# EAGLE schematic joyre_v1_1 (EAGLE 9.3.1)
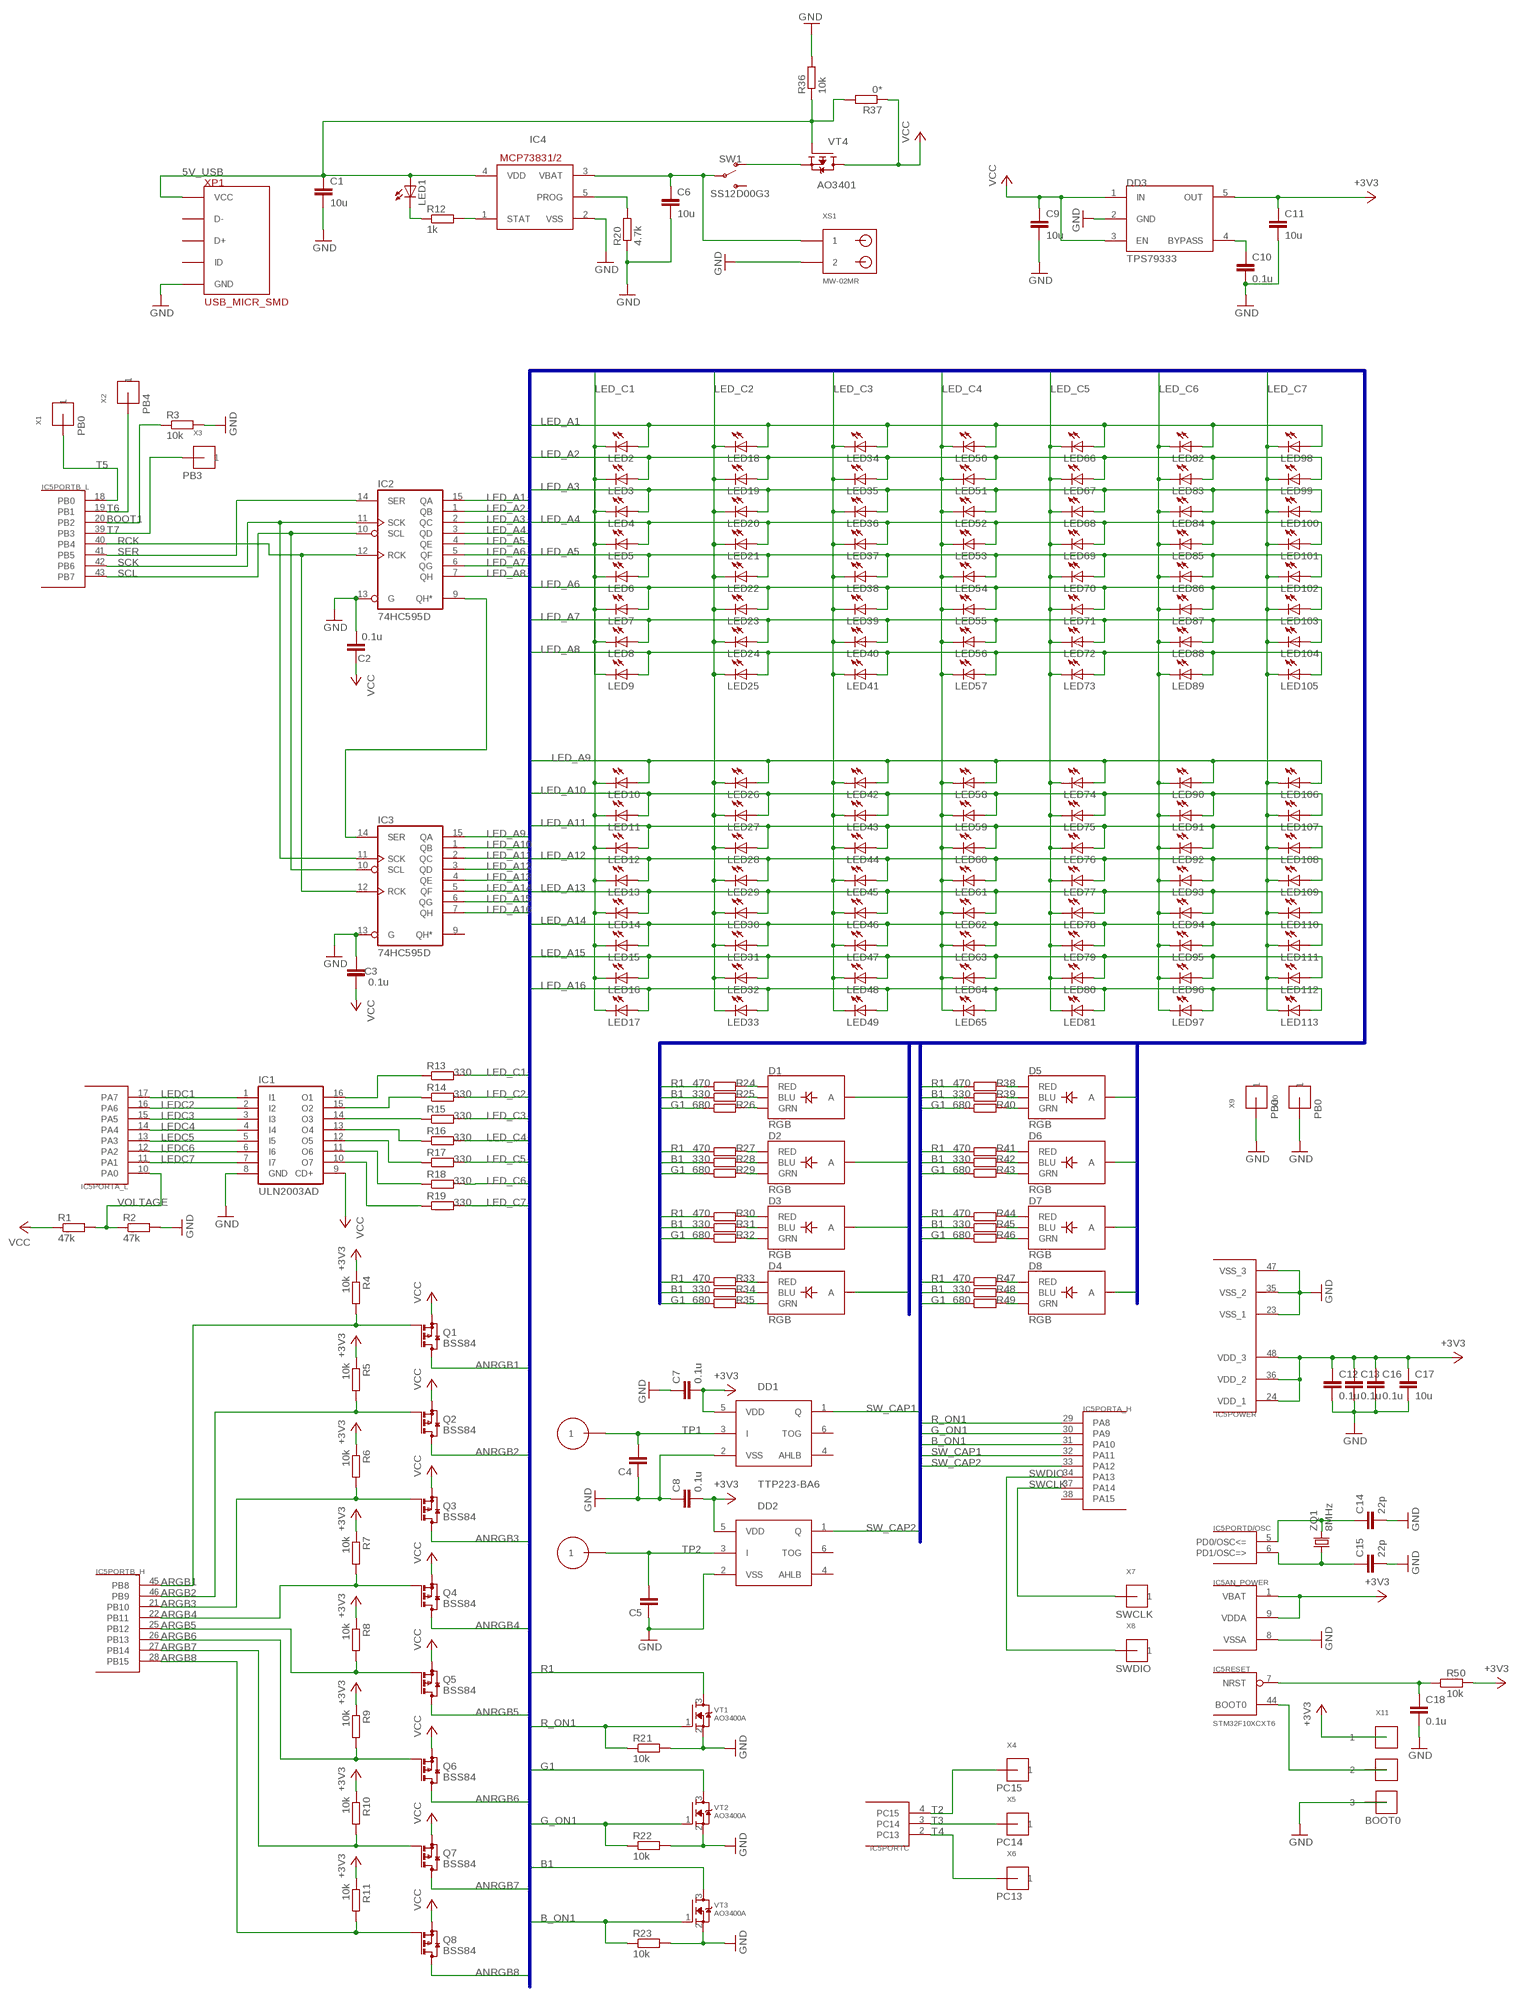
[diagram p0: schematic, sheet 1]

## Parts
C1  10u  C-EUC1206K  [C1206K]
C2  0.1u  C-EUC0603K  [C0603K]
C3  0.1u  C-EUC0603K  [C0603K]
C4  C-EUC0603K  [C0603K]
C5  C-EUC0603K  [C0603K]
C6  10u  C-EUC1206K  [C1206K]
C7  0.1u  C-EUC0603K  [C0603K]
C8  0.1u  C-EUC0603K  [C0603K]
C9  10u  C-EUC1206K  [C1206K]
C10  0.1u  C-EUC0603K  [C0603K]
C11  10u  C-EUC1206K  [C1206K]
C12  0.1u  C-EUC0603K  [C0603K]
C13  0.1u  C-EUC0603K  [C0603K]
C14  22p  C-EUC0603K  [C0603K]
C15  22p  C-EUC0603K  [C0603K]
C16  0.1u  C-EUC0603K  [C0603K]
C17  10u  C-EUC1206K  [C1206K]
C18  0.1u  C-EUC0603K  [C0603K]
D1  RGB  LED-RGB-CAPLCC  [P-LCC-4-3]
D2  RGB  LED-RGB-CAPLCC  [P-LCC-4-3]
D3  RGB  LED-RGB-CAPLCC  [P-LCC-4-3]
D4  RGB  LED-RGB-CAPLCC  [P-LCC-4-3]
D5  RGB  LED-RGB-CAPLCC  [P-LCC-4-3]
D6  RGB  LED-RGB-CAPLCC  [P-LCC-4-3]
D7  RGB  LED-RGB-CAPLCC  [P-LCC-4-3]
D8  RGB  LED-RGB-CAPLCC  [P-LCC-4-3]
DD1  TTP223-BA6  [TSOT23-6]
DD2  TTP223-BA6  [TSOT23-6]
DD3  TPS79333  [DBV_R-PDSO-G5]
IC1  ULN2003AD  [SO16]
IC2  74HC595D  [SO16]
IC3  74HC595D  [SO16]
IC4  MCP73831/OT  [SOT23-5L]
IC5  STM32F10XCXT6  [TQFP48]
LED1  LEDCHIPLED_0805  [CHIPLED_0805]
LED2  LEDCHIPLED_0805  [CHIPLED_0805]
LED3  LEDCHIPLED_0805  [CHIPLED_0805]
LED4  LEDCHIPLED_0805  [CHIPLED_0805]
LED5  LEDCHIPLED_0805  [CHIPLED_0805]
LED6  LEDCHIPLED_0805  [CHIPLED_0805]
LED7  LEDCHIPLED_0805  [CHIPLED_0805]
LED8  LEDCHIPLED_0805  [CHIPLED_0805]
LED9  LEDCHIPLED_0805  [CHIPLED_0805]
LED10  LEDCHIPLED_0805  [CHIPLED_0805]
LED11  LEDCHIPLED_0805  [CHIPLED_0805]
LED12  LEDCHIPLED_0805  [CHIPLED_0805]
LED13  LEDCHIPLED_0805  [CHIPLED_0805]
LED14  LEDCHIPLED_0805  [CHIPLED_0805]
LED15  LEDCHIPLED_0805  [CHIPLED_0805]
LED16  LEDCHIPLED_0805  [CHIPLED_0805]
LED17  LEDCHIPLED_0805  [CHIPLED_0805]
LED18  LEDCHIPLED_0805  [CHIPLED_0805]
LED19  LEDCHIPLED_0805  [CHIPLED_0805]
LED20  LEDCHIPLED_0805  [CHIPLED_0805]
LED21  LEDCHIPLED_0805  [CHIPLED_0805]
LED22  LEDCHIPLED_0805  [CHIPLED_0805]
LED23  LEDCHIPLED_0805  [CHIPLED_0805]
LED24  LEDCHIPLED_0805  [CHIPLED_0805]
LED25  LEDCHIPLED_0805  [CHIPLED_0805]
LED26  LEDCHIPLED_0805  [CHIPLED_0805]
LED27  LEDCHIPLED_0805  [CHIPLED_0805]
LED28  LEDCHIPLED_0805  [CHIPLED_0805]
LED29  LEDCHIPLED_0805  [CHIPLED_0805]
LED30  LEDCHIPLED_0805  [CHIPLED_0805]
LED31  LEDCHIPLED_0805  [CHIPLED_0805]
LED32  LEDCHIPLED_0805  [CHIPLED_0805]
LED33  LEDCHIPLED_0805  [CHIPLED_0805]
LED34  LEDCHIPLED_0805  [CHIPLED_0805]
LED35  LEDCHIPLED_0805  [CHIPLED_0805]
LED36  LEDCHIPLED_0805  [CHIPLED_0805]
LED37  LEDCHIPLED_0805  [CHIPLED_0805]
LED38  LEDCHIPLED_0805  [CHIPLED_0805]
LED39  LEDCHIPLED_0805  [CHIPLED_0805]
LED40  LEDCHIPLED_0805  [CHIPLED_0805]
LED41  LEDCHIPLED_0805  [CHIPLED_0805]
LED42  LEDCHIPLED_0805  [CHIPLED_0805]
LED43  LEDCHIPLED_0805  [CHIPLED_0805]
LED44  LEDCHIPLED_0805  [CHIPLED_0805]
LED45  LEDCHIPLED_0805  [CHIPLED_0805]
LED46  LEDCHIPLED_0805  [CHIPLED_0805]
LED47  LEDCHIPLED_0805  [CHIPLED_0805]
LED48  LEDCHIPLED_0805  [CHIPLED_0805]
LED49  LEDCHIPLED_0805  [CHIPLED_0805]
LED50  LEDCHIPLED_0805  [CHIPLED_0805]
LED51  LEDCHIPLED_0805  [CHIPLED_0805]
LED52  LEDCHIPLED_0805  [CHIPLED_0805]
LED53  LEDCHIPLED_0805  [CHIPLED_0805]
LED54  LEDCHIPLED_0805  [CHIPLED_0805]
LED55  LEDCHIPLED_0805  [CHIPLED_0805]
LED56  LEDCHIPLED_0805  [CHIPLED_0805]
LED57  LEDCHIPLED_0805  [CHIPLED_0805]
LED58  LEDCHIPLED_0805  [CHIPLED_0805]
LED59  LEDCHIPLED_0805  [CHIPLED_0805]
LED60  LEDCHIPLED_0805  [CHIPLED_0805]
LED61  LEDCHIPLED_0805  [CHIPLED_0805]
LED62  LEDCHIPLED_0805  [CHIPLED_0805]
LED63  LEDCHIPLED_0805  [CHIPLED_0805]
LED64  LEDCHIPLED_0805  [CHIPLED_0805]
LED65  LEDCHIPLED_0805  [CHIPLED_0805]
LED66  LEDCHIPLED_0805  [CHIPLED_0805]
LED67  LEDCHIPLED_0805  [CHIPLED_0805]
LED68  LEDCHIPLED_0805  [CHIPLED_0805]
LED69  LEDCHIPLED_0805  [CHIPLED_0805]
LED70  LEDCHIPLED_0805  [CHIPLED_0805]
LED71  LEDCHIPLED_0805  [CHIPLED_0805]
LED72  LEDCHIPLED_0805  [CHIPLED_0805]
LED73  LEDCHIPLED_0805  [CHIPLED_0805]
LED74  LEDCHIPLED_0805  [CHIPLED_0805]
LED75  LEDCHIPLED_0805  [CHIPLED_0805]
LED76  LEDCHIPLED_0805  [CHIPLED_0805]
LED77  LEDCHIPLED_0805  [CHIPLED_0805]
LED78  LEDCHIPLED_0805  [CHIPLED_0805]
LED79  LEDCHIPLED_0805  [CHIPLED_0805]
LED80  LEDCHIPLED_0805  [CHIPLED_0805]
LED81  LEDCHIPLED_0805  [CHIPLED_0805]
LED82  LEDCHIPLED_0805  [CHIPLED_0805]
LED83  LEDCHIPLED_0805  [CHIPLED_0805]
LED84  LEDCHIPLED_0805  [CHIPLED_0805]
LED85  LEDCHIPLED_0805  [CHIPLED_0805]
LED86  LEDCHIPLED_0805  [CHIPLED_0805]
LED87  LEDCHIPLED_0805  [CHIPLED_0805]
LED88  LEDCHIPLED_0805  [CHIPLED_0805]
LED89  LEDCHIPLED_0805  [CHIPLED_0805]
LED90  LEDCHIPLED_0805  [CHIPLED_0805]
LED91  LEDCHIPLED_0805  [CHIPLED_0805]
LED92  LEDCHIPLED_0805  [CHIPLED_0805]
LED93  LEDCHIPLED_0805  [CHIPLED_0805]
LED94  LEDCHIPLED_0805  [CHIPLED_0805]
LED95  LEDCHIPLED_0805  [CHIPLED_0805]
LED96  LEDCHIPLED_0805  [CHIPLED_0805]
LED97  LEDCHIPLED_0805  [CHIPLED_0805]
LED98  LEDCHIPLED_0805  [CHIPLED_0805]
LED99  LEDCHIPLED_0805  [CHIPLED_0805]
LED100  LEDCHIPLED_0805  [CHIPLED_0805]
LED101  LEDCHIPLED_0805  [CHIPLED_0805]
LED102  LEDCHIPLED_0805  [CHIPLED_0805]
LED103  LEDCHIPLED_0805  [CHIPLED_0805]
LED104  LEDCHIPLED_0805  [CHIPLED_0805]
LED105  LEDCHIPLED_0805  [CHIPLED_0805]
LED106  LEDCHIPLED_0805  [CHIPLED_0805]
LED107  LEDCHIPLED_0805  [CHIPLED_0805]
LED108  LEDCHIPLED_0805  [CHIPLED_0805]
LED109  LEDCHIPLED_0805  [CHIPLED_0805]
LED110  LEDCHIPLED_0805  [CHIPLED_0805]
LED111  LEDCHIPLED_0805  [CHIPLED_0805]
LED112  LEDCHIPLED_0805  [CHIPLED_0805]
LED113  LEDCHIPLED_0805  [CHIPLED_0805]
Q1  BSS84  [SOT23]
Q2  BSS84  [SOT23]
Q3  BSS84  [SOT23]
Q4  BSS84  [SOT23]
Q5  BSS84  [SOT23]
Q6  BSS84  [SOT23]
Q7  BSS84  [SOT23]
Q8  BSS84  [SOT23]
R1  47k  R-EU_R0603  [R0603]
R2  47k  R-EU_R0603  [R0603]
R3  10k  R-EU_R0603  [R0603]
R4  10k  R-EU_R0603  [R0603]
R5  10k  R-EU_R0603  [R0603]
R6  10k  R-EU_R0603  [R0603]
R7  10k  R-EU_R0603  [R0603]
R8  10k  R-EU_R0603  [R0603]
R9  10k  R-EU_R0603  [R0603]
R10  10k  R-EU_R0603  [R0603]
R11  10k  R-EU_R0603  [R0603]
R12  1k  R-EU_R0603  [R0603]
R13  330  R-EU_R0603  [R0603]
R14  330  R-EU_R0603  [R0603]
R15  330  R-EU_R0603  [R0603]
R16  330  R-EU_R0603  [R0603]
R17  330  R-EU_R0603  [R0603]
R18  330  R-EU_R0603  [R0603]
R19  330  R-EU_R0603  [R0603]
R20  4.7k  R-EU_R0603  [R0603]
R21  10k  R-EU_R0603  [R0603]
R22  10k  R-EU_R0603  [R0603]
R23  10k  R-EU_R0603  [R0603]
R24  470  R-EU_R0603  [R0603]
R25  330  R-EU_R0603  [R0603]
R26  680  R-EU_R0603  [R0603]
R27  470  R-EU_R0603  [R0603]
R28  330  R-EU_R0603  [R0603]
R29  680  R-EU_R0603  [R0603]
R30  470  R-EU_R0603  [R0603]
R31  330  R-EU_R0603  [R0603]
R32  680  R-EU_R0603  [R0603]
R33  470  R-EU_R0603  [R0603]
R34  330  R-EU_R0603  [R0603]
R35  680  R-EU_R0603  [R0603]
R36  10k  R-EU_R0603  [R0603]
R37  0*  R-EU_R0603  [R0603]
R38  470  R-EU_R0603  [R0603]
R39  330  R-EU_R0603  [R0603]
R40  680  R-EU_R0603  [R0603]
R41  470  R-EU_R0603  [R0603]
R42  330  R-EU_R0603  [R0603]
R43  680  R-EU_R0603  [R0603]
R44  470  R-EU_R0603  [R0603]
R45  330  R-EU_R0603  [R0603]
R46  680  R-EU_R0603  [R0603]
R47  470  R-EU_R0603  [R0603]
R48  330  R-EU_R0603  [R0603]
R49  680  R-EU_R0603  [R0603]
R50  10k  R-EU_R0603  [R0603]
SW1  SS12D00G3  [SS12D00G3]
VT1  AO3400A  [SOT23]
VT2  AO3400A  [SOT23]
VT3  AO3400A  [SOT23]
VT4  AO3401  [SOT23]
X1  PB0  1PIN_SMD_3X2  [1PIN_SMD_3X2]
X2  PB4  1PIN_SMD_3X2  [1PIN_SMD_3X2]
X3  PB3  1PIN_SMD_3X2  [1PIN_SMD_3X2]
X4  PC15  1PIN_SMD_3X2  [1PIN_SMD_3X2]
X5  PC14  1PIN_SMD_3X2  [1PIN_SMD_3X2]
X6  PC13  1PIN_SMD_3X2  [1PIN_SMD_3X2]
X7  SWCLK  1PIN_SMD_3X2  [1PIN_SMD_3X2]
X8  SWDIO  1PIN_SMD_3X2  [1PIN_SMD_3X2]
X9  PB0  1PIN_SMD_3X2  [1PIN_SMD_3X2]
X10  PB0  1PIN_SMD_3X2  [1PIN_SMD_3X2]
X11  BOOT0  3PIN_SOLDER  [3PIN_SOLDER]
XC1  CAP_PIN  [CAP_PIN]
XC2  CAP_PIN  [CAP_PIN]
XP1  USB_MICR_SMD  [USB_MICR_SMD]
XS1  MW-02MR  [CWF-2R]
ZQ1  8MHz  HC49SM  [HC49SM]

## Nets
5V_USB: C1.1 IC4.4(VDD) LED1.A R36.1 R37.2 VT4.1(G) XP1.P$1(VCC)
+3V3 [power]: C7.2 C8.2 C11.1 C12.1 C13.1 C16.1 C17.1 DD1.5(VDD) DD2.5(VDD) DD3.5(OUT) IC5.1(AN_POWER:VBAT) IC5.9(AN_POWER:VDDA) IC5.24(POWER:VDD_1) IC5.36(POWER:VDD_2) IC5.48(POWER:VDD_3) R4.1 R5.1 R6.1 R7.1 R8.1 R9.1 R10.1 R11.1 R50.2 X11.1
ANRGB1: D1.4(A) Q1.3(D)
ANRGB2: D2.4(A) Q2.3(D)
ANRGB3: D3.4(A) Q3.3(D)
ANRGB4: D4.4(A) Q4.3(D)
ANRGB5: D5.4(A) Q5.3(D)
ANRGB6: D6.4(A) Q6.3(D)
ANRGB7: D7.4(A) Q7.3(D)
ANRGB8: D8.4(A) Q8.3(D)
ARGB1: IC5.45(PORTB_H:PB8) Q1.1(G) R4.2
ARGB2: IC5.46(PORTB_H:PB9) Q2.1(G) R5.2
ARGB3: IC5.21(PORTB_H:PB10) Q3.1(G) R6.2
ARGB4: IC5.22(PORTB_H:PB11) Q4.1(G) R7.2
ARGB5: IC5.25(PORTB_H:PB12) Q5.1(G) R8.2
ARGB6: IC5.26(PORTB_H:PB13) Q6.1(G) R9.2
ARGB7: IC5.27(PORTB_H:PB14) Q7.1(G) R10.2
ARGB8: IC5.28(PORTB_H:PB15) Q8.1(G) R11.2
B1: R25.1 R28.1 R31.1 R34.1 R39.1 R42.1 R45.1 R48.1 VT3.3(D)
B_ON1: IC5.31(PORTA_H:PA10) R23.1 VT3.1(G)
BOOT1: IC5.20(PORTB_L:PB2) R3.1
G1: R26.1 R29.1 R32.1 R35.1 R40.1 R43.1 R46.1 R49.1 VT2.3(D)
G_ON1: IC5.30(PORTA_H:PA9) R22.1 VT2.1(G)
GND [power]: C1.2 C2.2 C3.2 C4.1 C5.1 C6.2 C7.1 C8.1 C9.2 C10.2 C11.2 C12.2 C13.2 C14.2 C15.2 C16.2 C17.2 C18.2 DD1.2(VSS) DD2.2(VSS) DD3.2(GND) IC1.8(GND) IC2.13(G) IC3.13(G) IC4.2(VSS) IC5.8(AN_POWER:VSSA) IC5.23(POWER:VSS_1) IC5.35(POWER:VSS_2) IC5.47(POWER:VSS_3) R2.2 R3.2 R20.1 R21.2 R22.2 R23.2 R36.2 VT1.2(S) VT2.2(S) VT3.2(S) X9.P$1 X10.P$1 X11.3 XP1.P$5(GND) XS1.P$2
LED_A1: IC2.15(QA) LED2.A LED18.A LED34.A LED50.A LED66.A LED82.A LED98.A
LED_A2: IC2.1(QB) LED3.A LED19.A LED35.A LED51.A LED67.A LED83.A LED99.A
LED_A3: IC2.2(QC) LED4.A LED20.A LED36.A LED52.A LED68.A LED84.A LED100.A
LED_A4: IC2.3(QD) LED5.A LED21.A LED37.A LED53.A LED69.A LED85.A LED101.A
LED_A5: IC2.4(QE) LED6.A LED22.A LED38.A LED54.A LED70.A LED86.A LED102.A
LED_A6: IC2.5(QF) LED7.A LED23.A LED39.A LED55.A LED71.A LED87.A LED103.A
LED_A7: IC2.6(QG) LED8.A LED24.A LED40.A LED56.A LED72.A LED88.A LED104.A
LED_A8: IC2.7(QH) LED9.A LED25.A LED41.A LED57.A LED73.A LED89.A LED105.A
LED_A9: IC3.15(QA) LED10.A LED26.A LED42.A LED58.A LED74.A LED90.A LED106.A
LED_A10: IC3.1(QB) LED11.A LED27.A LED43.A LED59.A LED75.A LED91.A LED107.A
LED_A11: IC3.2(QC) LED12.A LED28.A LED44.A LED60.A LED76.A LED92.A LED108.A
LED_A12: IC3.3(QD) LED13.A LED29.A LED45.A LED61.A LED77.A LED93.A LED109.A
LED_A13: IC3.4(QE) LED14.A LED30.A LED46.A LED62.A LED78.A LED94.A LED110.A
LED_A14: IC3.5(QF) LED15.A LED31.A LED47.A LED63.A LED79.A LED95.A LED111.A
LED_A15: IC3.6(QG) LED16.A LED32.A LED48.A LED64.A LED80.A LED96.A LED112.A
LED_A16: IC3.7(QH) LED17.A LED33.A LED49.A LED65.A LED81.A LED97.A LED113.A
LED_C1: LED2.C LED3.C LED4.C LED5.C LED6.C LED7.C LED8.C LED9.C LED10.C LED11.C LED12.C LED13.C LED14.C LED15.C LED16.C LED17.C R13.2
LED_C2: LED18.C LED19.C LED20.C LED21.C LED22.C LED23.C LED24.C LED25.C LED26.C LED27.C LED28.C LED29.C LED30.C LED31.C LED32.C LED33.C R14.2
LED_C3: LED34.C LED35.C LED36.C LED37.C LED38.C LED39.C LED40.C LED41.C LED42.C LED43.C LED44.C LED45.C LED46.C LED47.C LED48.C LED49.C R15.2
LED_C4: LED50.C LED51.C LED52.C LED53.C LED54.C LED55.C LED56.C LED57.C LED58.C LED59.C LED60.C LED61.C LED62.C LED63.C LED64.C LED65.C R16.2
LED_C5: LED66.C LED67.C LED68.C LED69.C LED70.C LED71.C LED72.C LED73.C LED74.C LED75.C LED76.C LED77.C LED78.C LED79.C LED80.C LED81.C R17.2
LED_C6: LED82.C LED83.C LED84.C LED85.C LED86.C LED87.C LED88.C LED89.C LED90.C LED91.C LED92.C LED93.C LED94.C LED95.C LED96.C LED97.C R18.2
LED_C7: LED98.C LED99.C LED100.C LED101.C LED102.C LED103.C LED104.C LED105.C LED106.C LED107.C LED108.C LED109.C LED110.C LED111.C LED112.C LED113.C R19.2
LEDC1: IC1.1(I1) IC5.17(PORTA_L:PA7)
LEDC2: IC1.2(I2) IC5.16(PORTA_L:PA6)
LEDC3: IC1.3(I3) IC5.15(PORTA_L:PA5)
LEDC4: IC1.4(I4) IC5.14(PORTA_L:PA4)
LEDC5: IC1.5(I5) IC5.13(PORTA_L:PA3)
LEDC6: IC1.6(I6) IC5.12(PORTA_L:PA2)
LEDC7: IC1.7(I7) IC5.11(PORTA_L:PA1)
N$1: D1.1(RED) R24.2
N$2: D1.3(BLU) R25.2
N$3: D1.2(GRN) R26.2
N$4: D2.1(RED) R27.2
N$5: D2.3(BLU) R28.2
N$6: D2.2(GRN) R29.2
N$7: D3.2(GRN) R32.2
N$8: D3.3(BLU) R31.2
N$9: D3.1(RED) R30.2
N$10: D4.2(GRN) R35.2
N$11: D4.3(BLU) R34.2
N$12: D4.1(RED) R33.2
N$13: D8.2(GRN) R49.2
N$14: D8.3(BLU) R48.2
N$15: D8.1(RED) R47.2
N$16: D7.2(GRN) R46.2
N$17: D7.3(BLU) R45.2
N$18: D7.1(RED) R44.2
N$19: D6.2(GRN) R43.2
N$20: D6.3(BLU) R42.2
N$21: D6.1(RED) R41.2
N$22: D5.1(RED) R38.2
N$23: D5.3(BLU) R39.2
N$24: D5.2(GRN) R40.2
N$25: IC1.10(O7) R19.1
N$26: IC1.11(O6) R18.1
N$27: IC1.12(O5) R17.1
N$28: IC1.13(O4) R16.1
N$29: IC1.14(O3) R15.1
N$30: IC1.15(O2) R14.1
N$31: IC1.16(O1) R13.1
N$32: SW1.1(O) VT4.2(S)
N$34: IC5.44(RESET:BOOT0) X11.2
N$40: IC2.9(QH*) IC3.14(SER)
N$42: IC4.1(STAT) R12.2
N$54: C10.1 DD3.4(BYPASS)
N$57: IC4.5(PROG) R20.2
N$60: C6.1 IC4.3(VBAT) SW1.2(P) XS1.P$1
N$61: LED1.C R12.1
N$64: C14.1 IC5.5(PORTD/OSC:PD0/OSC<=) ZQ1.2
N$65: C15.1 IC5.6(PORTD/OSC:PD1/OSC=>) ZQ1.1
N$67: C18.1 IC5.7(RESET:NRST) R50.1
R1: R24.1 R27.1 R30.1 R33.1 R38.1 R41.1 R44.1 R47.1 VT1.3(D)
R_ON1: IC5.29(PORTA_H:PA8) R21.1 VT1.1(G)
RCK: IC2.12(RCK) IC3.12(RCK) IC5.40(PORTB_L:PB4)
SCK: IC2.11(SCK) IC3.11(SCK) IC5.42(PORTB_L:PB6)
SCL: IC2.10(SCL) IC3.10(SCL) IC5.43(PORTB_L:PB7)
SER: IC2.14(SER) IC5.41(PORTB_L:PB5)
SW_CAP1: DD1.1(Q) IC5.32(PORTA_H:PA11)
SW_CAP2: DD2.1(Q) IC5.33(PORTA_H:PA12)
SWCLK: IC5.37(PORTA_H:PA14) X7.P$1
SWDIO: IC5.34(PORTA_H:PA13) X8.P$1
T2: IC5.4(PORTC:PC15) X4.P$1
T3: IC5.3(PORTC:PC14) X5.P$1
T4: IC5.2(PORTC:PC13) X6.P$1
T5: IC5.18(PORTB_L:PB0) X1.P$1
T6: IC5.19(PORTB_L:PB1) X2.P$1
T7: IC5.39(PORTB_L:PB3) X3.P$1
TP1: C4.2 DD1.3(I) XC1.P$1
TP2: C5.2 DD2.3(I) XC2.P$1
VCC [power]: C2.1 C3.1 C9.1 DD3.1(IN) DD3.3(EN) IC1.9(CD+) Q1.2(S) Q2.2(S) Q3.2(S) Q4.2(S) Q5.2(S) Q6.2(S) Q7.2(S) Q8.2(S) R1.1 R37.1 VT4.3(D)
VOLTAGE: IC5.10(PORTA_L:PA0) R1.2 R2.1
Unconnected: DD1.4(AHLB) DD1.6(TOG) DD2.4(AHLB) DD2.6(TOG) IC3.9(QH*) IC5.38(PORTA_H:PA15) SW1.3(S) XP1.P$2(D-) XP1.P$3(D+) XP1.P$4(ID)

## Buses
ANRGB[1..8],B1,B_ON1,G1,G_ON1,LED_A[1..16],LED_C[1..14],R1,R_ON1,SW_CAP[1..2]

## Power pins joined to a net without a drawn wire
GND: IC2.8(GND) IC3.8(GND)
VCC: IC2.16(VCC) IC3.16(VCC)

## Library data of the parts
C1-C18 = rcl:C-EU: CAPACITOR, European symbol; SPICEPREFIX: C
D1-D8 = SparkFun-LED:LED-RGB-CA: LED-RGB Diffused Common Anode Packages: LED RGB-THRU P-LCC-4-3 LED-TRICOLOR-SMD SparkFun Products: RGB Diffused Common Anode- Diffuse <[https://www.sparkfun.com/products/10821]> RGB Diffused Common Anode - Clear <[https://www.sparkfun.com/products/10820]> Qduino Mini <[https://www.sparkfun.com/products/13614]> Triple Output LED RGB - SMD <https://www.sparkfun.com/products/7844>; PROD_ID: DIO-12986
DD1 DD2 = joyre:TTP223-BA6
DD3 = joyre1:TPS79333
IC1 = uln-udn:ULN2003A: DRIVER ARRAY
IC2 IC3 = 74xx-eu:74*595: 8-bit SHIFT REGISTER, output latch
IC4 = adafruit:MCP73831: MCP73831/2 Miniature Single-Cell, Fully Integrated Li-Ion, Li-Polymer Charge Management Controllers. Nice and small simple lipoly charge controller, with adjustable current and status output (LED) http://www.ladyada.net/library/pcb/eaglelibrary.html
IC5 = stm32:STM32F10XCXT6: ST STM32F101/103 48pin LQFP
LED1-LED113 = adafruit:LED: LED OSRAM: - CHIPLED LG R971, LG N971, LY N971, LG Q971, LY Q971, LO R971, LY R971 LH N974, LH R974 LS Q976, LO Q976, LY Q976 LO Q996 - Hyper CHIPLED LW Q18S LB Q993, LB Q99A, LB R99A - SideLED LS A670, LO A670, LY A670, LG A670, LP A670 LB A673, LV A673, LT A673, LW A673 LH A674 LY A675 LS A676, LA A676, LO A676, LY A676, LW A676 LS A679, LY A679, LG A679 - Hyper Micro SIDELED® LS Y876, LA Y876, LO Y876, LY Y876 LT Y87S - SmartLED LW L88C, LW L88S LB L89C, LB L89S, LG L890 LS L89K, LO L89K, LY L89K LS L896, LA L896, LO L896, LY L896 - TOPLED LS T670, LO T670, LY T670, LG T670, LP T670 LSG T670, LSP T670, LSY T670, LOP T670, LYG T670 LG T671, LOG T671, LSG T671 LB T673, LV T673, LT T673, LW T673 LH T674 LS T676, LA T676, LO T676, LY T676, LB T676, LH T676, LSB T676, LW T676 LB T67C, LV T67C, LT T67C, LS T67K, LO T67K, LY T67K, LW E67C LS E67B, LA E67B, LO E67B, LY E67B, LB E67C, LV E67C, LT E67C LW T67C LS T679, LY T679, LG T679 LS T770, LO T770, LY T770, LG T770, LP T770 LB T773, LV T773, LT T773, LW T773 LH T774 LS E675, LA E675, LY E675, LS T675 LS T776, LA T776, LO T776, LY T776, LB T776 LHGB T686 LT T68C, LB T68C - Hyper Mini TOPLED® LB M676 - Mini TOPLED Santana® LG M470 LS M47K, LO M47K, LY M47K Source: http://www.osram.convergy.de/
Q1-Q8 = transistor-small-signal:BSS84: P-CHANNEL MOS FET
R1-R3 R12-R20 R24-R49 = resistor:R-EU_: RESISTOR, European symbol
R4-R11 R21-R23 R50 = rcl:R-EU_: RESISTOR, European symbol; SPICEPREFIX: R
SW1 = joyre:SS12D00G3
VT1-VT3 = joyre:AO3400A
VT4 = joyre:AO3401: P-channel MOSFET -30V, 3A, 60mOhm
X1-X10 = joyre:1PIN_SMD_3X2
X11 = joyre:3PIN_SOLDER
XC1 XC2 = joyre:CAP_PIN
XP1 = joyre:USB_MICR_SMD
XS1 = joyre:MW-02MR
ZQ1 = joyre:HC49SM